# EAGLE design GeneralController (EAGLE 5.06)
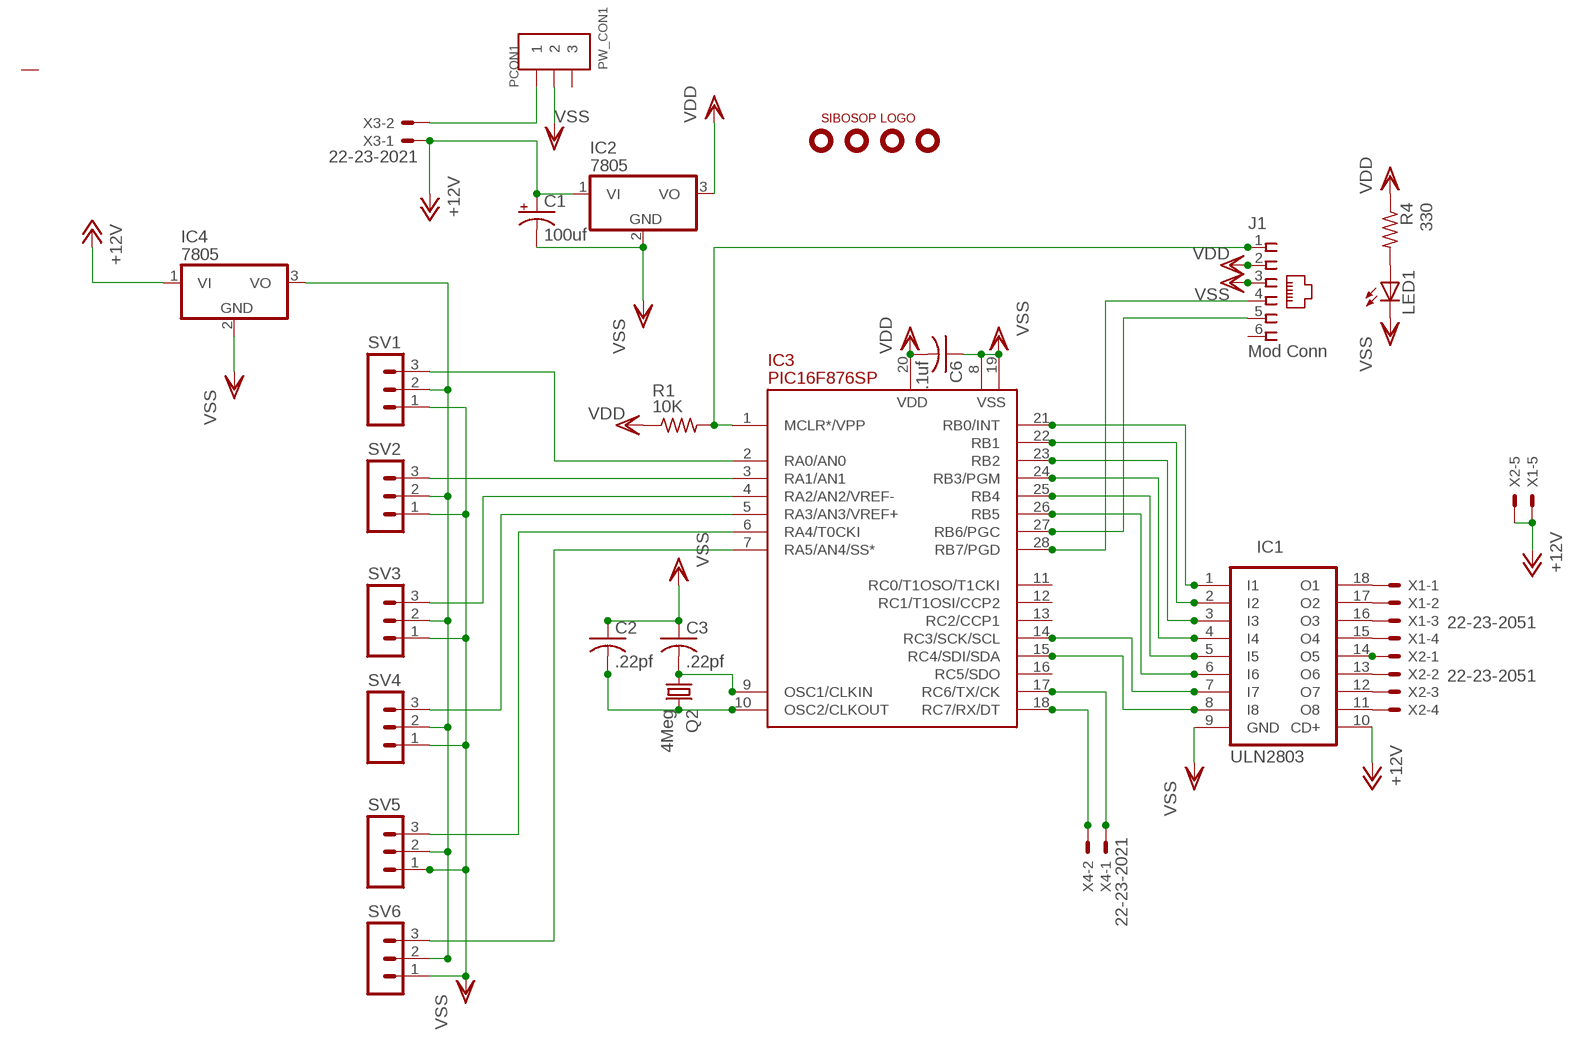
[diagram p0: schematic, sheet 1]

## Parts
C1  100uf  CPOL-USE3.5-10  [E3,5-10]
C2  .22pf  C-US025-024X044  [C025-024X044]
C3  .22pf  C-US025-024X044  [C025-024X044]
C6  .1uf  C-US025-024X044  [C025-024X044]
IC1  ULN2803  ULN2803A  [DIL18]
IC2  7805  [TO220V]
IC3  PIC16F876SP  [DIL28-3]
IC4  7805  [TO220V]
J1  Mod Conn  520250-3  [520250-3]
LED1  LEDSQR2X5  [LED2X5]
PCON1  PW_CON1  [PW_CON1]
Q2  4Meg  CRYSTALHC49S  [HC49/S]
R1  10K  R-US_0204/2V  [0204V]
R4  330  R-US_0204/2V  [0204V]
SV1  MA03-1  [MA03-1]
SV2  MA03-1  [MA03-1]
SV3  MA03-1  [MA03-1]
SV4  MA03-1  [MA03-1]
SV5  MA03-1  [MA03-1]
SV6  MA03-1  [MA03-1]
U$1  HOLE-125  [HOLE-125]
U$2  HOLE-125  [HOLE-125]
U$3  LOGO  [LOGO]
U$5  HOLE-125  [HOLE-125]
U$7  HOLE-125  [HOLE-125]
X1  22-23-2051  [22-23-2051]
X2  22-23-2051  [22-23-2051]
X3  22-23-2021  [22-23-2021]
X4  22-23-2021  [22-23-2021]

## Nets
090: IC3.27(RB6/PGC) J1.5
+12V: C1.+ IC1.10(CD+) IC2.1(VI) IC4.1(VI) X1.5 X2.5 X3.1
N$1: IC3.1(MCLR*/VPP) J1.1 R1.2
N$2: IC4.3(VO) SV1.2 SV2.2 SV3.2 SV4.2 SV5.2 SV6.2
N$3: C2.2 IC3.10(OSC2/CLKOUT) Q2.2
N$4: C3.2 IC3.9(OSC1/CLKIN) Q2.1
N$5: IC1.1(I1) IC3.21(RB0/INT)
N$6: IC1.2(I2) IC3.22(RB1)
N$7: IC1.3(I3) IC3.23(RB2)
N$8: IC1.4(I4) IC3.24(RB3/PGM)
N$9: IC1.5(I5) IC3.25(RB4)
N$10: IC1.6(I6) IC3.26(RB5)
N$11: IC1.7(I7) IC3.14(RC3/SCK/SCL)
N$12: IC1.8(I8) IC3.15(RC4/SDI/SDA)
N$15: IC1.18(O1) X1.1
N$16: IC1.17(O2) X1.2
N$17: IC1.16(O3) X1.3
N$18: IC1.15(O4) X1.4
N$19: IC1.14(O5) X2.1
N$20: IC1.13(O6) X2.2
N$21: IC3.28(RB7/PGD) J1.4
N$22: LED1.A R4.2
N$23: IC1.12(O7) X2.3
N$24: IC3.18(RC7/RX/DT) X4.2
N$25: IC3.2(RA0/AN0) SV1.3
N$26: IC3.3(RA1/AN1) SV2.3
N$27: IC3.4(RA2/AN2/VREF-) SV3.3
N$28: IC3.5(RA3/AN3/VREF+) SV4.3
N$29: IC3.6(RA4/T0CKI) SV5.3
N$30: IC3.7(RA5/AN4/SS*) SV6.3
N$31: PCON1.P$1 X3.2
N$32: IC3.17(RC6/TX/CK) X4.1
N$33: IC1.11(O8) X2.4
VDD: C6.2 IC2.3(VO) IC3.20(VDD) J1.2 R1.1 R4.1
VSS: C1.- C2.1 C3.1 C6.1 IC1.9(GND) IC2.2(GND) IC3.8(VSS) IC3.19(VSS) IC4.2(GND) J1.3 LED1.K(C) PCON1.P$2 SV1.1 SV2.1 SV3.1 SV4.1 SV5.1 SV6.1
Unconnected: IC3.11(RC0/T1OSO/T1CKI) IC3.12(RC1/T1OSI/CCP2) IC3.13(RC2/CCP1) IC3.16(RC5/SDO) J1.6 PCON1.P$3

## Library data of the parts
C1 = rcl:CPOL-US: POLARIZED CAPACITOR, American symbol
C2 C3 C6 = rcl:C-US: CAPACITOR, American symbol
IC1 = uln-udn:ULN2803A: DRIVER ARRAY
IC2 IC4 = kmarx1:78*: 78xx Family - Positive voltage regulator
IC3 = pic16f87x:PIC16F876: FLASH MICROCONTROLLER
J1 = con-amp:520250-3: AMP connector
LED1 = led:LED: LED OSRAM: - CHIPLED LG R971, LG N971, LY N971, LG Q971, LY Q971, LO R971, LY R971 LH N974, LH R974 LS Q976, LO Q976, LY Q976 LO Q996 - Hyper CHIPLED LW Q18S LB Q993, LB Q99A, LB R99A - SideLED LS A670, LO A670, LY A670, LG A670, LP A670 LB A673, LV A673, LT A673, LW A673 LH A674 LY A675 LS A676, LA A676, LO A676, LY A676, LW A676 LS A679, LY A679, LG A679 - Hyper Micro SIDELED® LS Y876, LA Y876, LO Y876, LY Y876 LT Y87S - SmartLED LW L88C, LW L88S LB L89C, LB L89S, LG L890 LS L89K, LO L89K, LY L89K LS L896, LA L896, LO L896, LY L896 - TOPLED LS T670, LO T670, LY T670, LG T670, LP T670 LSG T670, LSP T670, LSY T670, LOP T670, LYG T670 LG T671, LOG T671, LSG T671 LB T673, LV T673, LT T673, LW T673 LH T674 LS T676, LA T676, LO T676, LY T676, LB T676, LH T676, LSB T676, LW T676 LB T67C, LV T67C, LT T67C, LS T67K, LO T67K, LY T67K, LW E67C LS E67B, LA E67B, LO E67B, LY E67B, LB E67C, LV E67C, LT E67C LW T67C LS T679, LY T679, LG T679 LS T770, LO T770, LY T770, LG T770, LP T770 LB T773, LV T773, LT T773, LW T773 LH T774 LS E675, LA E675, LY E675, LS T675 LS T776, LA T776, LO T776, LY T776, LB T776 LHGB T686 LT T68C, LB T68C - Hyper Mini TOPLED® LB M676 - Mini TOPLED Santana® LG M470 LS M47K, LO M47K, LY M47K Source: http://www.osram.convergy.de LUXEON: - LUMILED® LXK2-PW12-R00, LXK2-PW12-S00, LXK2-PW14-U00, LXK2-PW14-V00 LXK2-PM12-R00, LXK2-PM12-S00, LXK2-PM14-U00 LXK2-PE12-Q00, LXK2-PE12-R00, LXK2-PE12-S00, LXK2-PE14-T00, LXK2-PE14-U00 LXK2-PB12-K00, LXK2-PB12-L00, LXK2-PB12-M00, LXK2-PB14-N00, LXK2-PB14-P00, LXK2-PB14-Q00 LXK2-PR12-L00, LXK2-PR12-M00, LXK2-PR14-Q00, LXK2-PR14-R00 LXK2-PD12-Q00, LXK2-PD12-R00, LXK2-PD12-S00 LXK2-PH12-R00, LXK2-PH12-S00 LXK2-PL12-P00, LXK2-PL12-Q00, LXK2-PL12-R00 Source: www.luxeon.com KINGBRIGHT: KA-3528ASYC Source: www.kingbright.com
PCON1 = powerconnectorskt:PW_CON1
Q2 = crystal:CRYSTAL: CRYSTAL
R1 R4 = rcl:R-US_: RESISTOR, American symbol
SV1-SV6 = con-lstb:MA03-1: PIN HEADER
U$1 U$2 U$5 U$7 = sibosop:HOLE-125
U$3 = sibosop:LOGO
X1 X2 = sibosop-con-molex:22-23-2051: .100" (2.54mm) Center Header - 5 Pin
X3 X4 = sibosop-con-molex:22-23-2021: .100" (2.54mm) Center Header - 2 Pin

## Board
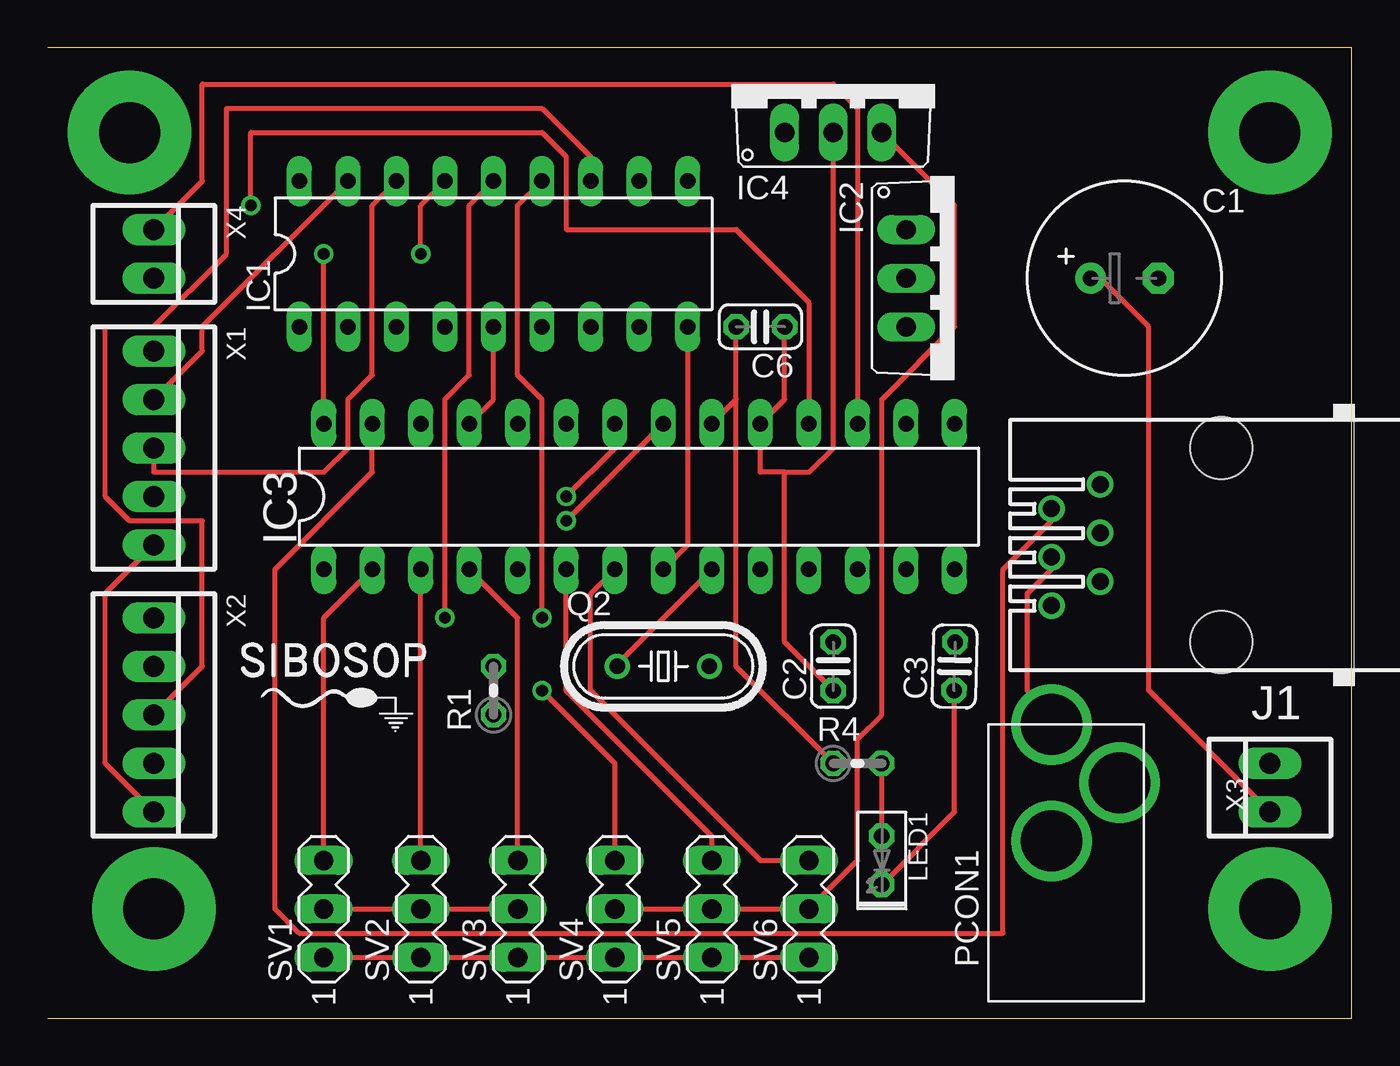
[diagram p1: board, top side]
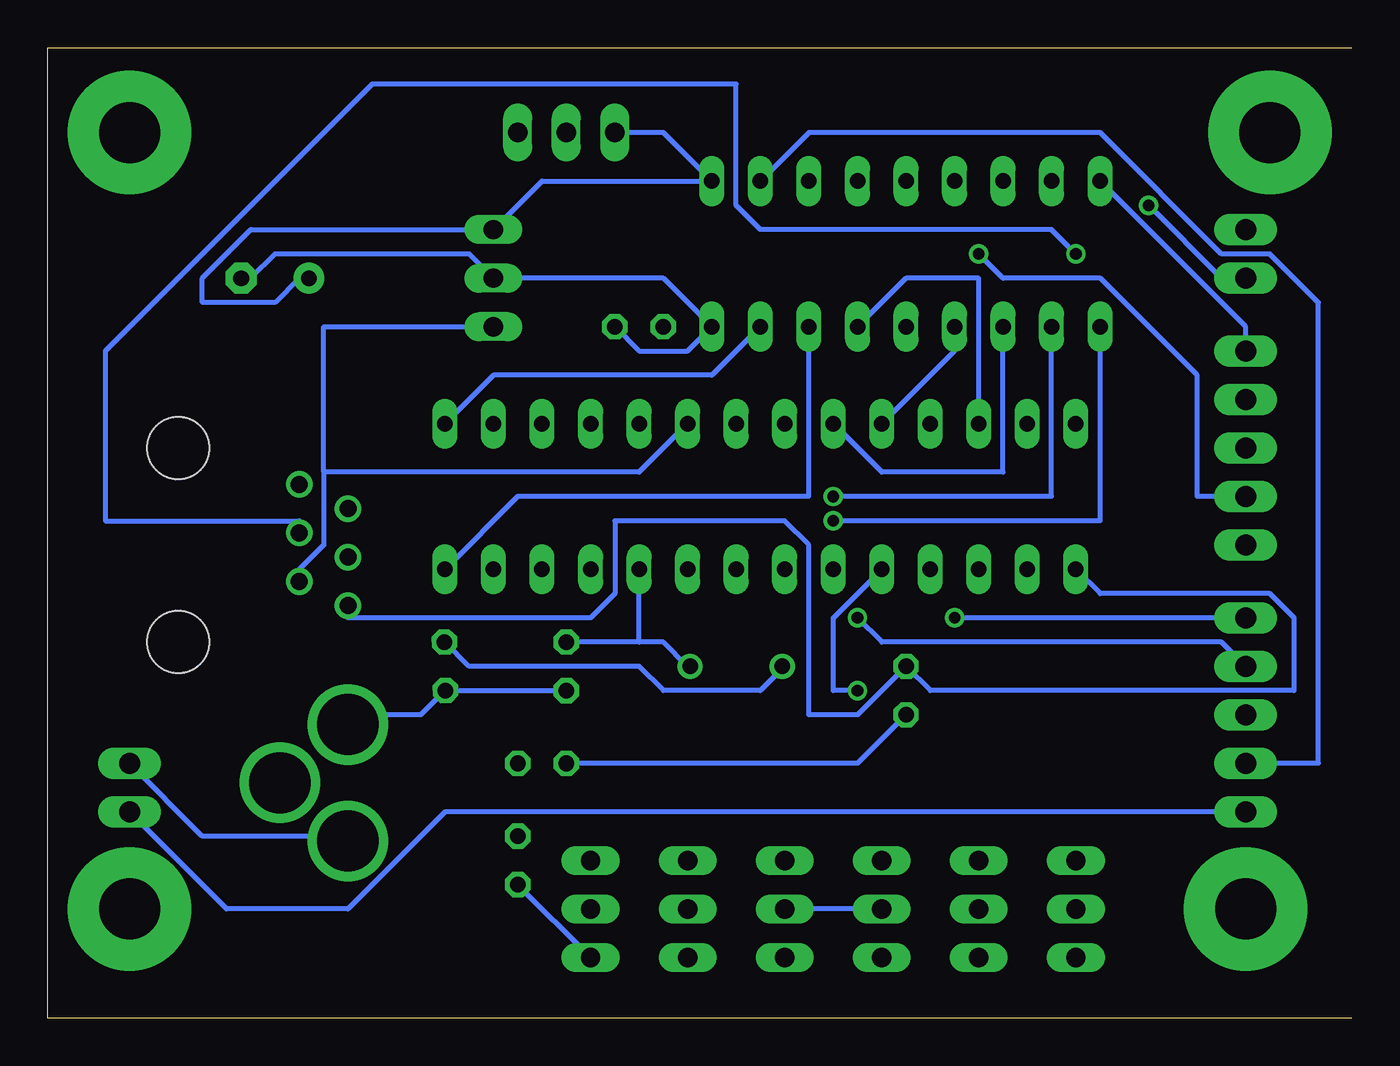
[diagram p2: board, bottom side, seen from below]

Size 68.25 x 50.79 mm. Coordinates in mm from the lower left corner, seen from the top.
Outline: 0,0 68.25,0 68.25,50.79 0,50.79
Copper layers (1*16): Top 0.035mm / dielectric 1.5mm / Bottom 0.035mm
Design rules "default": minimum track width 10mil, minimum drill 24mil, track to track 8mil, track to pad 8mil, pad to pad 8mil, via to via 8mil, smd to smd 8mil, copper to edge 40mil, drill to drill 8mil, minimum pad ring 10mil, minimum via ring 8mil, stop-mask expansion 4mil, vias tented up to drill 0mil, thermal gap 10mil

### Footprints (pad centres in the part's own frame; a part is rotated, then mirrored left to right if it is on the bottom)
E3,5-10 = drill 0.813 pad 1.6 round: + -1.778,0 | drill 0.813 pad 1.6 octagon: - 1.778,0
C025-024X044 = drill 0.813 octagon: 1 -1.27,0; 2 1.27,0
DIL18 = drill 0.813 long: 1 -10.16,-3.81; 2 -7.62,-3.81; 3 -5.08,-3.81; 4 -2.54,-3.81; 5 0,-3.81; 6 2.54,-3.81; 7 5.08,-3.81; 8 7.62,-3.81; 9 10.16,-3.81; 10 10.16,3.81; 11 7.62,3.81; 12 5.08,3.81; 13 2.54,3.81; 14 0,3.81; 15 -2.54,3.81; 16 -5.08,3.81; 17 -7.62,3.81; 18 -10.16,3.81
TO220V = drill 1.016 long: 1 -2.54,0; 2 0,0; 3 2.54,0
DIL28-3 = drill 0.813 long: 1 -16.51,-3.81; 2 -13.97,-3.81; 3 -11.43,-3.81; 4 -8.89,-3.81; 5 -6.35,-3.81; 6 -3.81,-3.81; 7 -1.27,-3.81; 8 1.27,-3.81; 9 3.81,-3.81; 10 6.35,-3.81; 11 8.89,-3.81; 12 11.43,-3.81; 13 13.97,-3.81; 14 16.51,-3.81; 15 16.51,3.81; 16 13.97,3.81; 17 11.43,3.81; 18 8.89,3.81; 19 6.35,3.81; 20 3.81,3.81; 21 1.27,3.81; 22 -1.27,3.81; 23 -3.81,3.81; 24 -6.35,3.81; 25 -8.89,3.81; 26 -11.43,3.81; 27 -13.97,3.81; 28 -16.51,3.81
520250-3 = drill 0.889 round: 1 -3.175,8.89; 2 -1.905,6.35; 3 -0.635,8.89; 4 0.635,6.35; 5 1.905,8.89; 6 3.175,6.35 | hole 3.251: -5.08,0; 5.08,0
LED2X5 = drill 0.813 octagon: A -1.27,0; K 1.27,0
PW_CON1 = drill 3.2 pad 3.81 round: P$1 -0.254,0; P$2 5.842,0; P$3 2.794,-3.556
HC49/S = drill 0.813 round: 1 -2.413,0; 2 2.413,0
0204V = drill 0.813 octagon: 1 -1.27,0; 2 1.27,0
MA03-1 = drill 1.016 long: 1 -2.54,0; 2 0,0; 3 2.54,0
HOLE-125 = drill 3.2 pad 6.452 round: P$1 0,0
22-23-2051 = drill 1.1 long: 1 -5.08,0; 2 -2.54,0; 3 0,0; 4 2.54,0; 5 5.08,0
22-23-2021 = drill 1.1 long: 1 -1.27,0; 2 1.27,0

### Placement (x,y rotation side)
C1  56.35,38.73 0 top
C2  41.11,18.41 90 top
C3  47.46,18.41 88.6 top
C6  37.3,36.19 180 top
IC1  23.33,40 0 top
IC2  44.92,38.73 270 top
IC3  30.95,27.3 0 top
IC4  41.11,46.35 0 top
J1  61.43,24.76 90 top
LED1  43.65,8.25 270 top
PCON1  52.54,9.52 90 top
Q2  32.22,18.41 0 top
R1  23.33,17.14 90 top
R4  42.38,13.33 0 top
SV1  14.44,5.71 90 top
SV2  19.52,5.71 90 top
SV3  24.6,5.71 90 top
SV4  29.68,5.71 90 top
SV5  34.76,5.71 90 top
SV6  39.84,5.71 90 top
U$1  63.97,46.35 0 top
U$2  4.28,46.35 0 top
U$3  14.44,18.41 0 top
U$5  5.55,5.71 0 top
U$7  63.97,5.71 0 top
X1  5.55,29.84 270 top
X2  5.55,15.87 270 top
X3  63.97,12.06 90 top
X4  5.55,40 270 top

### Tracks (layer width: path | path; a pad name or v marks a point on that pad's centre or on a via)
090
  Top 0.254: IC3.27 16.98,28.57 11.9,23.49 11.9,5.71 13.17,4.44 50,4.44 50,23.49 52.54,26.03 J1.5
+12V
  Top 0.254: X2.5 3.01,13.33 3.01,22.22 X1.5 | X3.1 57.62,17.14 57.62,36.19 55.08,38.73 C1.+
  Bottom 0.254: IC4.1 36.03,46.35 IC1.10 42.38,43.81 IC2.1 57.62,41.27 60.16,38.73 60.16,37.46 56.35,37.46 55.08,38.73 C1.+ | X2.5 47.46,10.79 52.54,5.71 58.89,5.71 X3.1
N$1
  Bottom 0.254: IC3.1 13.17,22.22 4.28,22.22 3.01,20.95 3.01,17.14 22.06,17.14 R1.2 25.87,15.87 28.41,15.87 28.41,24.76 29.68,26.03 38.57,26.03 38.57,22.22 39.84,20.95 52.54,20.95 J1.1
N$2
  Top 0.254: SV1.2 SV2.2 SV3.2 | SV4.2 SV5.2 SV6.2 42.38,8.25 42.38,14.6 43.65,15.87 43.65,32.38 47.46,36.19 47.46,42.54 IC4.3
  Bottom 0.254: SV3.2 SV4.2
N$3
  Bottom 0.254: 37.3,19.68 C2.2 | 37.3,19.68 36.03,19.68 34.76,18.41 Q2.2 | 37.3,19.68 IC3.10
N$4
  Top 0.254: IC3.9 29.68,18.41 Q2.1
  Bottom 0.254: C3.2 47.46,19.68 46.19,18.41 37.3,18.41 36.03,17.14 30.95,17.14 29.68,18.41 Q2.1
N$5  (via drill 0.61)
  Top 0.254: v27.14,26.03 IC3.21
  Bottom 0.254: IC1.1 13.17,26.03 v27.14,26.03
N$6  (via drill 0.61)
  Top 0.254: v27.14,27.3 29.68,29.84 IC3.22
  Bottom 0.254: IC1.2 15.71,27.3 v27.14,27.3
N$7
  Bottom 0.254: IC1.3 18.25,28.57 24.6,28.57 IC3.23
N$8
  Bottom 0.254: IC3.24 20.79,34.92 IC1.4
N$9
  Top 0.254: IC3.25 23.33,32.38 IC1.5
N$10
  Bottom 0.254: IC3.26 19.52,38.73 23.33,38.73 IC1.6
N$11
  Bottom 0.254: IC1.7 28.41,27.3 43.65,27.3 IC3.14
N$12
  Bottom 0.254: IC1.8 33.49,33.65 44.92,33.65 IC3.15
N$15
  Bottom 0.254: IC1.18 5.55,36.19 X1.1
N$16
  Top 0.254: IC1.17 8.09,36.19 8.09,34.92 X1.2
N$17
  Top 0.254: IC1.16 16.98,42.54 16.98,33.65 15.71,32.38 15.71,29.84 14.44,28.57 5.55,28.57 X1.3
N$18  (via drill 0.61)
  Top 0.254: IC1.15 19.52,42.54 v19.52,40
  Bottom 0.254: v19.52,40 18.25,38.73 13.17,38.73 8.09,33.65 8.09,27.3 X1.4
N$19  (via drill 0.61)
  Top 0.254: IC1.14 22.06,42.54 22.06,33.65 20.79,32.38 v20.79,20.95
  Bottom 0.254: X2.1 v20.79,20.95
N$20  (via drill 0.61)
  Top 0.254: IC1.13 24.6,42.54 24.6,33.65 25.87,32.38 v25.87,20.95
  Bottom 0.254: v25.87,20.95 24.6,19.68 6.82,19.68 X2.2
N$21  (via drill 0.61)
  Top 0.254: IC3.28 v14.44,40
  Bottom 0.254: v14.44,40 15.71,41.27 30.95,41.27 32.22,42.54 32.22,48.89 51.27,48.89 65.24,34.92 65.24,26.03 55.08,26.03 J1.4
N$22
  Top 0.254: LED1.A R4.2
N$23
  Top 0.254: IC1.12 28.41,45.08 25.87,47.62 9.36,47.62 9.36,40 5.55,36.19 3.01,36.19 3.01,27.3 4.28,26.03 8.09,26.03 8.09,18.41 X2.3
N$24  (via drill 0.61)
  Top 0.254: IC3.18 39.84,37.46 36.03,41.27 27.14,41.27 27.14,45.08 25.87,46.35 10.63,46.35 v10.63,42.54
  Bottom 0.254: v10.63,42.54 6.82,38.73 X4.2
N$25
  Top 0.254: IC3.2 14.44,20.95 SV1.3
N$26
  Top 0.254: SV2.3 IC3.3
N$27
  Top 0.254: IC3.4 24.6,20.95 SV3.3
N$28  (via drill 0.61)
  Top 0.254: v25.87,17.14 29.68,13.33 SV4.3
  Bottom 0.254: IC3.5 27.14,20.95 27.14,17.14 v25.87,17.14
N$29
  Top 0.254: IC3.6 27.14,17.14 34.76,9.52 SV5.3
N$30
  Top 0.254: IC3.7 28.41,22.22 28.41,17.14 37.3,8.25 SV6.3
N$31
  Bottom 0.254: X3.2 60.16,9.52 52.54,9.52 PCON1.P$1
N$32
  Top 0.254: IC3.17 42.38,47.62 41.11,48.89 8.09,48.89 8.09,43.81 X4.1
N$33
  Bottom 0.254: IC1.11 28.41,46.35 13.17,46.35 6.82,40 4.28,40 1.74,37.46 1.74,13.33 X2.4
VDD
  Top 0.254: 36.03,32.38 IC3.20 | 36.03,32.38 C6.2 | R4.1 36.03,18.41 36.03,32.38
  Bottom 0.254: R1.1 25.87,13.33 R4.1 | 53.81,28.57 53.81,36.19 IC2.3 | 53.81,28.57 53.81,24.76 55.08,23.49 J1.2 | IC3.20 37.3,28.57 53.81,28.57
VSS
  Top 0.254: SV1.1 SV2.1 SV3.1 SV4.1 SV5.1 SV6.1 | J1.3 52.54,23.49 51.27,22.22 51.27,17.14 52.54,15.87 PCON1.P$2 | C6.1 38.57,32.38 IC3.19 37.3,28.57 38.57,28.57 | IC4.2 41.11,29.84 39.84,28.57 38.57,28.57 | IC3.8 33.49,24.76 IC1.9 | C2.1 38.57,19.68 38.57,28.57 | LED1.K 47.46,10.79 47.46,17.14 C3.1
  Bottom 0.254: SV6.1 LED1.K | 47.46,17.14 C2.1 | 47.46,17.14 48.73,15.87 52.54,15.87 PCON1.P$2 | C3.1 47.46,17.14 | C1.- 57.62,38.73 56.35,40 46.19,40 IC2.2 36.03,38.73 IC1.9 34.76,34.92 37.3,34.92 C6.1

### Text on the board
tValues: 11-04-2009